# Altium schematic sheet B2B_2.SchDoc: RFSOC_SAWG
size 420 x 297 mm; Author: G.Kasprowicz; CompanyName: WUT ISE; DrawnBy: G.Kasprowicz; Organization: WUT ISE; Address1: PW ISE; Address2: Nowowiejska 15/19 00-665 Warsaw; Address3: gkasprow@gmail.com; DocumentNumber: 11; Revision: 1; SheetNumber: 11; SheetTotal: 20; ModifiedBy: -; CheckedDate: -; Title2: B2B 2; DivGrp: WUT ISE; Designer: G.Kasprowicz; ModifiedDate: -; ProjectName: Sensor Box
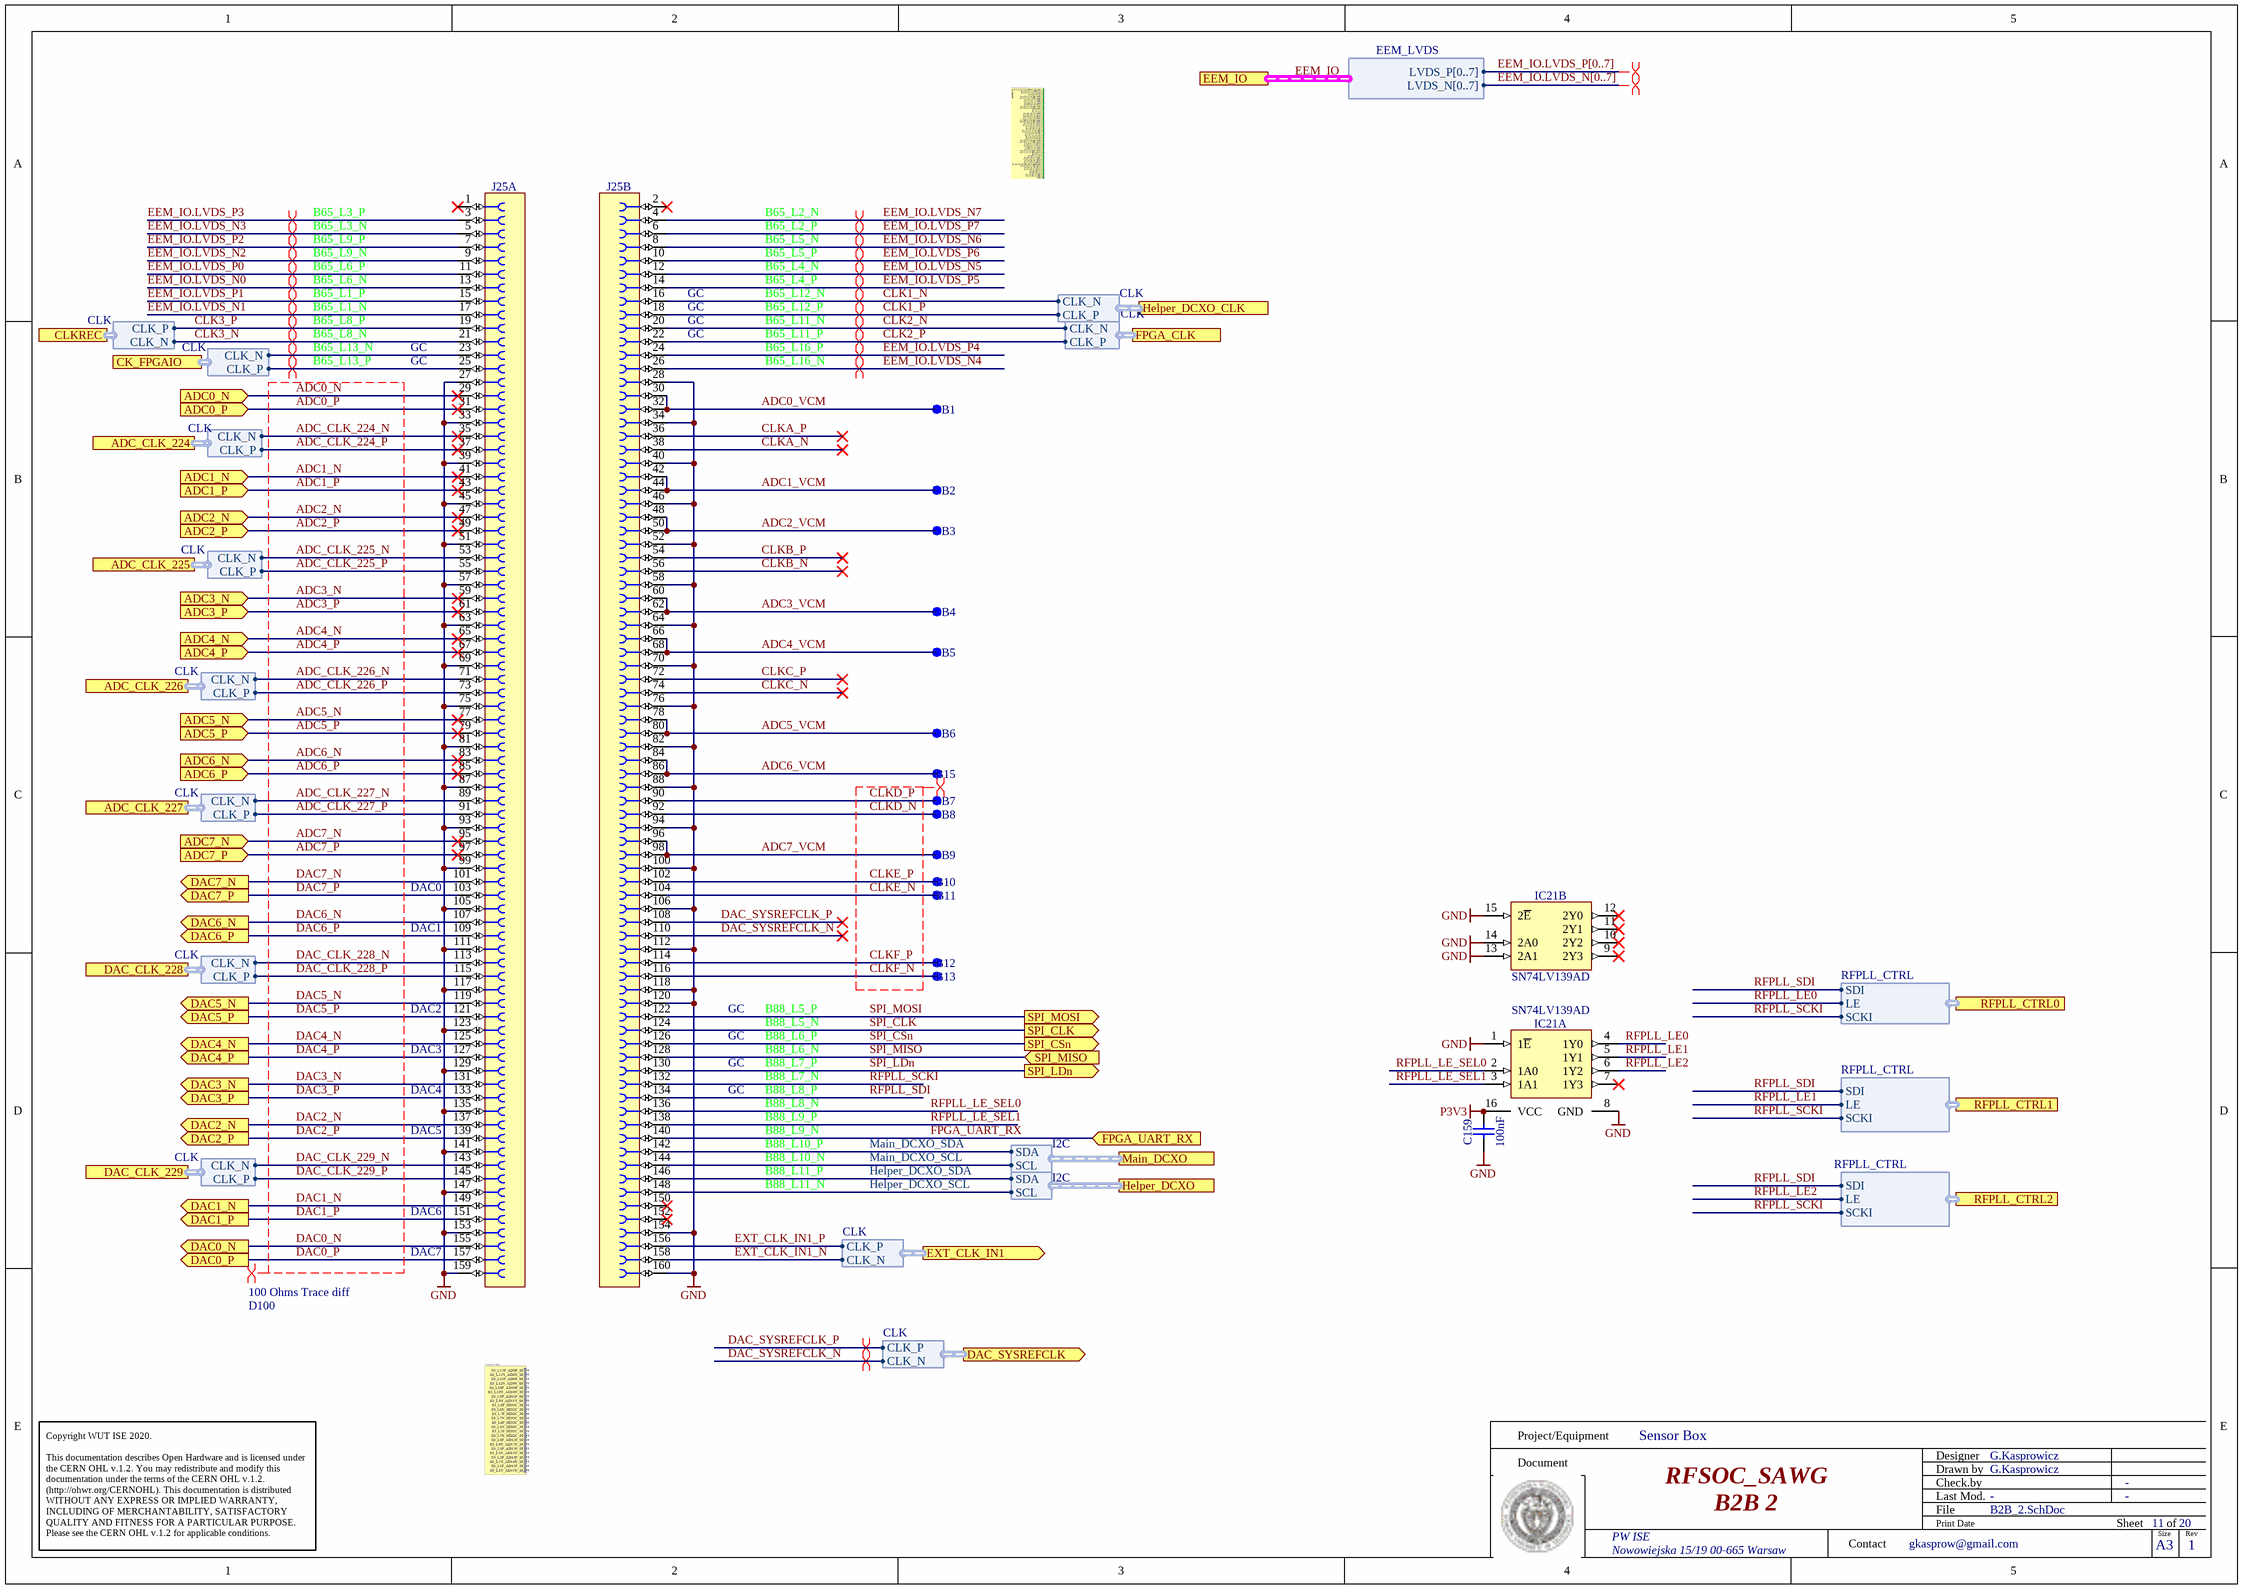
[diagram p0: B2B_2.SchDoc]

## Parts
B1  SMD Pad  [C100]  (value not drawn)  (no BOM)
B2  SMD Pad  [C100]  (value not drawn)  (no BOM)
B3  SMD Pad  [C100]  (value not drawn)  (no BOM)
B4  SMD Pad  [C100]  (value not drawn)  (no BOM)
B5  SMD Pad  [C100]  (value not drawn)  (no BOM)
B6  SMD Pad  [C100]  (value not drawn)  (no BOM)
B7  SMD Pad  [C100]  (value not drawn)  (no BOM)
B8  SMD Pad  [C100]  (value not drawn)  (no BOM)
B9  SMD Pad  [C100]  (value not drawn)  (no BOM)
B10  SMD Pad  [C100]  (value not drawn)  (no BOM)
B11  SMD Pad  [C100]  (value not drawn)  (no BOM)
B12  SMD Pad  [C100]  (value not drawn)  (no BOM)
B13  SMD Pad  [C100]  (value not drawn)  (no BOM)
B15  SMD Pad  [C100]  (value not drawn)  (no BOM)
C159  100nF  [CAPC1005X55N]
IC21  SN74LV139AD  [SOIC127P600X175-16N]  (parts A,B of 2)
J25  Socket 160  [SAMTEC_SS5-80-3.00-L-D-K]  (value not drawn)  (parts A,B of 2)

## Ports
ADC0_N (in), ADC0_P (in), ADC1_N (in), ADC1_P (in), ADC2_N (in), ADC2_P (in), ADC3_N (in), ADC3_P (in), ADC4_N (in), ADC4_P (in), ADC5_N (in), ADC5_P (in), ADC6_N (in), ADC6_P (in), ADC7_N (in), ADC7_P (in), ADC_CLK_224 (harness CLK), ADC_CLK_225 (harness CLK), ADC_CLK_226 (harness CLK), ADC_CLK_227 (harness CLK), CK_FPGAIO (harness CLK), CLKREC (harness CLK), DAC0_N (out), DAC0_P (out), DAC1_N (out), DAC1_P (out), DAC2_N (out), DAC2_P (out), DAC3_N (out), DAC3_P (out), DAC4_N (out), DAC4_P (out), DAC5_N (out), DAC5_P (out), DAC6_N (out), DAC6_P (out), DAC7_N (out), DAC7_P (out), DAC_CLK_228 (harness CLK), DAC_CLK_229 (harness CLK), DAC_SYSREFCLK (out, harness CLK), EEM_IO (harness EEM_LVDS), EXT_CLK_IN1 (out, harness CLK), FPGA_CLK (harness CLK), FPGA_UART_RX (in), Helper_DCXO (harness I2C), Helper_DCXO_CLK (harness CLK), Main_DCXO (harness I2C), RFPLL_CTRL0 (harness RFPLL_CTRL), RFPLL_CTRL1 (harness RFPLL_CTRL), RFPLL_CTRL2 (harness RFPLL_CTRL), SPI_CLK (out), SPI_CSn (out), SPI_LDn (out), SPI_MISO (in), SPI_MOSI (out)

## Harnesses
CLK: CLK_P, CLK_N
CLK: CLK_N, CLK_P
EEM_LVDS: LVDS_P[0..7], LVDS_N[0..7]
RFPLL_CTRL: SCKI, SDI, LE
I2C: SCL, SDA

## Nets
GND: C159.1 IC21.1(1~{E}) IC21.8(GND) IC21.13(2A1) IC21.14(2A0) IC21.15(2~{E}) J25.27 J25.28 J25.33 J25.34 J25.39 J25.40 J25.45 J25.46 J25.51 J25.52 J25.57 J25.58 J25.63 J25.64 J25.69 J25.70 J25.75 J25.76 J25.81 J25.82 J25.87 J25.88 J25.93 J25.94 J25.99 J25.100 J25.105 J25.106 J25.111 J25.112 J25.117 J25.118 J25.120 J25.123 J25.129 J25.135 J25.141 J25.147 J25.153 J25.154 J25.159 J25.160
P3V3: C159.2 IC21.16(VCC)
ADC0_N: J25.29 ; port ADC0_N
ADC0_P: J25.31 ; port ADC0_P
ADC0_VCM: B1.1 J25.30 J25.32
ADC1_N: J25.41 ; port ADC1_N
ADC1_P: J25.43 ; port ADC1_P
ADC1_VCM: B2.1 J25.42 J25.44
ADC2_N: J25.47 ; port ADC2_N
ADC2_P: J25.49 ; port ADC2_P
ADC2_VCM: B3.1 J25.48 J25.50
ADC3_N: J25.59 ; port ADC3_N
ADC3_P: J25.61 ; port ADC3_P
ADC3_VCM: B4.1 J25.60 J25.62
ADC4_N: J25.65 ; port ADC4_N
ADC4_P: J25.67 ; port ADC4_P
ADC4_VCM: B5.1 J25.66 J25.68
ADC5_N: J25.77 ; port ADC5_N
ADC5_P: J25.79 ; port ADC5_P
ADC5_VCM: B6.1 J25.78 J25.80
ADC6_N: J25.83 ; port ADC6_N
ADC6_P: J25.85 ; port ADC6_P
ADC6_VCM: B15.1 J25.84 J25.86
ADC7_N: J25.95 ; port ADC7_N
ADC7_P: J25.97 ; port ADC7_P
ADC7_VCM: B9.1 J25.96 J25.98
ADC_CLK_224_N: J25.35 ; port ADC_CLK_224.CLK_N
ADC_CLK_224_P: J25.37 ; port ADC_CLK_224.CLK_P
ADC_CLK_225_N: J25.53 ; port ADC_CLK_225.CLK_N
ADC_CLK_225_P: J25.55 ; port ADC_CLK_225.CLK_P
ADC_CLK_226_N: J25.71 ; port ADC_CLK_226.CLK_N
ADC_CLK_226_P: J25.73 ; port ADC_CLK_226.CLK_P
ADC_CLK_227_N: J25.89 ; port ADC_CLK_227.CLK_N
ADC_CLK_227_P: J25.91 ; port ADC_CLK_227.CLK_P
CLK1_N: J25.16 ; port Helper_DCXO_CLK.CLK_N
CLK1_P: J25.18 ; port Helper_DCXO_CLK.CLK_P
CLK2_N: J25.20 ; port FPGA_CLK.CLK_N
CLK2_P: J25.22 ; port FPGA_CLK.CLK_P
CLK3_N: J25.21 ; port CLKREC.CLK_N
CLK3_P: J25.19 ; port CLKREC.CLK_P
CLKA_N: J25.38
CLKA_P: J25.36
CLKB_N: J25.56
CLKB_P: J25.54
CLKC_N: J25.74
CLKC_P: J25.72
CLKD_N: B8.1 J25.92
CLKD_P: B7.1 J25.90
CLKE_N: B11.1 J25.104
CLKE_P: B10.1 J25.102
CLKF_N: B13.1 J25.116
CLKF_P: B12.1 J25.114
DAC0_N: J25.155 ; port DAC0_N
DAC0_P: J25.157 ; port DAC0_P
DAC1_N: J25.149 ; port DAC1_N
DAC1_P: J25.151 ; port DAC1_P
DAC2_N: J25.137 ; port DAC2_N
DAC2_P: J25.139 ; port DAC2_P
DAC3_N: J25.131 ; port DAC3_N
DAC3_P: J25.133 ; port DAC3_P
DAC4_N: J25.125 ; port DAC4_N
DAC4_P: J25.127 ; port DAC4_P
DAC5_N: J25.119 ; port DAC5_N
DAC5_P: J25.121 ; port DAC5_P
DAC6_N: J25.107 ; port DAC6_N
DAC6_P: J25.109 ; port DAC6_P
DAC7_N: J25.101 ; port DAC7_N
DAC7_P: J25.103 ; port DAC7_P
DAC_CLK_228_N: J25.113 ; port DAC_CLK_228.CLK_N
DAC_CLK_228_P: J25.115 ; port DAC_CLK_228.CLK_P
DAC_CLK_229_N: J25.143 ; port DAC_CLK_229.CLK_N
DAC_CLK_229_P: J25.145 ; port DAC_CLK_229.CLK_P
DAC_SYSREFCLK_N: J25.110 ; port DAC_SYSREFCLK.CLK_N
DAC_SYSREFCLK_P: J25.108 ; port DAC_SYSREFCLK.CLK_P
EEM_IO.LVDS_N0: J25.13
EEM_IO.LVDS_N1: J25.17
EEM_IO.LVDS_N2: J25.9
EEM_IO.LVDS_N3: J25.5
EEM_IO.LVDS_N4: J25.26
EEM_IO.LVDS_N5: J25.12
EEM_IO.LVDS_N6: J25.8
EEM_IO.LVDS_N7: J25.4
EEM_IO.LVDS_P0: J25.11
EEM_IO.LVDS_P1: J25.15
EEM_IO.LVDS_P2: J25.7
EEM_IO.LVDS_P3: J25.3
EEM_IO.LVDS_P4: J25.24
EEM_IO.LVDS_P5: J25.14
EEM_IO.LVDS_P6: J25.10
EEM_IO.LVDS_P7: J25.6
EXT_CLK_IN1_N: J25.158 ; port EXT_CLK_IN1.CLK_N
EXT_CLK_IN1_P: J25.156 ; port EXT_CLK_IN1.CLK_P
FPGA_UART_RX: J25.140 ; port FPGA_UART_RX
Helper_DCXO_SCL: J25.148 ; port Helper_DCXO.SCL
Helper_DCXO_SDA: J25.146 ; port Helper_DCXO.SDA
Main_DCXO_SCL: J25.144 ; port Main_DCXO.SCL
Main_DCXO_SDA: J25.142 ; port Main_DCXO.SDA
RFPLL_LE0: IC21.4(1Y0) ; port RFPLL_CTRL0.LE
RFPLL_LE1: IC21.5(1Y1) ; port RFPLL_CTRL1.LE
RFPLL_LE2: IC21.6(1Y2) ; port RFPLL_CTRL2.LE
RFPLL_LE_SEL0: IC21.2(1A0) J25.136
RFPLL_LE_SEL1: IC21.3(1A1) J25.138
RFPLL_SCKI: J25.132 ; port RFPLL_CTRL0.SCKI, port RFPLL_CTRL1.SCKI, port RFPLL_CTRL2.SCKI
RFPLL_SDI: J25.134 ; port RFPLL_CTRL0.SDI, port RFPLL_CTRL1.SDI, port RFPLL_CTRL2.SDI
SPI_CLK: J25.124 ; port SPI_CLK
SPI_CSn: J25.126 ; port SPI_CSn
SPI_LDn: J25.130 ; port SPI_LDn
SPI_MISO: J25.128 ; port SPI_MISO
SPI_MOSI: J25.122 ; port SPI_MOSI
NetJ25_23: J25.23 ; port CK_FPGAIO.CLK_N
NetJ25_25: J25.25 ; port CK_FPGAIO.CLK_P

Not connected (* = marked no-connect by the designer): IC21 7(1Y3)* 9(2Y3)* 10(2Y2)* 11(2Y1)* 12(2Y0)*; J25 1* 2* 150* 152*

## Buses and harness runs
bus EEM_IO.LVDS_N[0..7]
bus EEM_IO.LVDS_P[0..7]
harness EEM_IO = port EEM_IO

## Layout directives
differential pair; differential pair class 100 Ohms Trace diff; net class D100: ADC0_N, ADC0_P, ADC1_N, ADC1_P, ADC2_N, ADC2_P, ADC3_N, ADC3_P, ADC4_N, ADC4_P, ADC5_N, ADC5_P, ADC6_N, ADC6_P, ADC7_N, ADC7_P, ADC_CLK_224_N, ADC_CLK_224_P, ADC_CLK_225_N, ADC_CLK_225_P, ADC_CLK_226_N, ADC_CLK_226_P, ADC_CLK_227_N, ADC_CLK_227_P, DAC0_N, DAC0_P, DAC1_N, DAC1_P, DAC2_N, DAC2_P, DAC3_N, DAC3_P, DAC4_N, DAC4_P, DAC5_N, DAC5_P, DAC6_N, DAC6_P, DAC7_N, DAC7_P, DAC_CLK_228_N, DAC_CLK_228_P, DAC_CLK_229_N, DAC_CLK_229_P
differential pair: CLK1_N, CLK1_P, CLK2_N, CLK2_P, CLK3_N, CLK3_P, CLKD_N, CLKD_P, CLKE_N, CLKE_P, CLKF_N, CLKF_P, DAC_SYSREFCLK_N, DAC_SYSREFCLK_P, EEM_IO.LVDS_N0, EEM_IO.LVDS_N1, EEM_IO.LVDS_N2, EEM_IO.LVDS_N3, EEM_IO.LVDS_N4, EEM_IO.LVDS_N5, EEM_IO.LVDS_N6, EEM_IO.LVDS_N7, EEM_IO.LVDS_P0, EEM_IO.LVDS_P1, EEM_IO.LVDS_P2, EEM_IO.LVDS_P3, EEM_IO.LVDS_P4, EEM_IO.LVDS_P5, EEM_IO.LVDS_P6, EEM_IO.LVDS_P7, NetJ25_23, NetJ25_25
differential pair; differential pair class Diff_100Ohm: (no net found under the mark)

## Notes on the sheet
- B65_L3_P
- B65_L3_N
- B65_L9_P
- B65_L9_N
- B65_L2_N
- B65_L2_P
- B65_L5_N
- B65_L5_P
- B65_L6_P
- B65_L6_N
- B65_L1_P
- B65_L1_N
- B65_L8_P
- (near J25) GC
- B65_L4_N
- B65_L4_P
- B65_L12_N
- B65_L12_P
- B65_L11_N
- B65_L8_N
- B65_L13_N
- B65_L13_P
- GC
- B65_L11_P
- B65_L16_P
- B65_L16_N
- (near J25) DAC0
- (near J25) DAC1
- (near J25) DAC2
- (near J25) DAC3
- B88_L5_P
- B88_L5_N
- B88_L6_P
- B88_L6_N
- B88_L7_P
- (near J25) DAC4
- (near J25) DAC5
- B88_L7_N
- B88_L8_P
- B88_L8_N
- B88_L9_P
- B88_L9_N
- B88_L10_P
- B88_L10_N
- B88_L11_P
- B88_L11_N
- (near J25) DAC6
- (near J25) DAC7
- Project/Equipment
- Document
- Designer
- Drawn by
- Check.by
- Copyright WUT ISE 2020.
  This documentation describes Open Hardware and is licensed under the CERN OHL v.1.2. You may redistribute and modify this documentation under the terms of the CERN OHL v.1.2. (http://ohwr.org/CERNOHL). This documentation is distributed WITHOUT ANY EXPRESS OR IMPLIED WARRANTY, INCLUDING OF MERCHANTABILITY, SATISFACTORY QUALITY AND FITNESS FOR A PARTICULAR PURPOSE. Please see the CERN OHL v.1.2 for applicable conditions.
- Contact
- File
- Last Mod.
- Print Date
- Sheet
- Size
- A3
- of
- Rev

## Library data of the parts
B1-B13 B15 = SMD_PAD_D1MM: Through Hole Pad; Part Description: 1mm Diameter SMD Pad; Mounted: No; Part Number: SMD_PAD_D1MM; Component Type: Standard (No BOM); Pin Count: 1; Family: SMD Pad; Socket: No; SMD: No; Sense: No; Status: None; ComponentHeight: 0mm; HelpURL: Undefined; Author: CERN DEM JLC; CreateDate: 10.10.2017; LatestRevisionDate: 10.10.2017; PackageDescription: 1mm Diameter SMD Pad
C159 = CC0402_100NF_16V_10%_X7R: Non-polarised capacitor; Part Description: SMD Multilayer Chip Ceramic Capacitor; Manufacturer: GENERIC; Manufacturer1 Part Number: GRM155R71C104KA88D; Voltage: 16V; TC: X7R; Tolerance: ±10%; Part Number: CC0402_100NF_16V_10%_X7R; Component Kind: Standard; Component Type: Standard; Pin Count: 2; Value: 100nF; Status: Not Recommended; Manufacturer Part Number: CC0402_100NF_16V_10%_X7R; Case: 0402; Mounted: Yes; Socket: No; SMD: Yes; Sense: No; Manufacturer1 Example: MURATA; Manufacturer1 ComponentHeight: 0.55mm; HelpURL: \\cern.ch\dfs\Applications\Altium\Datasheets\CC0402_X7R_MURATA_GRM.pdf; Author: CERN DEM JLC; CreateDate: 05/12/2013; LatestRevisionDate: 03/12/2007
IC21 = SN74LV139AD: Dual 2-to-4 line decoder/demultiplexer; Manufacturer: TEXAS INSTRUMENTS; PressFit: No; Bonding: No; Part Number: SN74LV139AD; Component Kind: Standard; Component Type: Standard; Device: SN74LV139AD; PackageDescription: SOIC 16, Pitch 1.27mm - Body 4x10mm, IPC Medium Density; Part Description: Dual 2-to-4 Line Decoder/Demultiplexer; Manufacturer Part Number: SN74LV139AD; Pin Count: 16; Case: SOIC16; Mounted: Yes; Socket: No; SMD: Yes; Sense: No; ComponentHeight: 1.75mm; Author: CERN DEM JLC; HelpURL: \\cern.ch\dfs\Applications\Altium\Datasheets\SN74LV139AD.pdf; CreateDate: 25.01.2012; LatestRevisionDate: 25.01.2012
J25 = SAMTEC_SS5-80-3.00-L-D-K: Connector 160 Female; Part Description: 160 Contacts, Pitch 0.50 mm Micro Blade & Beam Low-Profile Socket; Manufacturer: SAMTEC; PressFit: No; Part Number: SAMTEC_SS5-80-3.00-L-D-K; Component Kind: Standard; Component Type: Standard; Pin Count: 160; Family: Socket 160; Mounted: Yes; Socket: No; SMD: Yes; Sense: No; Status: None; Manufacturer Part Number: SS5-80-3.00-L-D-K; ComponentHeight: 4mm; HelpURL: \\cern.ch\dfs\Applications\Altium\Datasheets\SAMTEC_SS5-80-3.00-L-D-K.pdf; Author: CERN DEM BC; CreateDate: 11.08.2021; LatestRevisionDate: 11.08.2021